# Altium project Panelmeter.PrjPcb
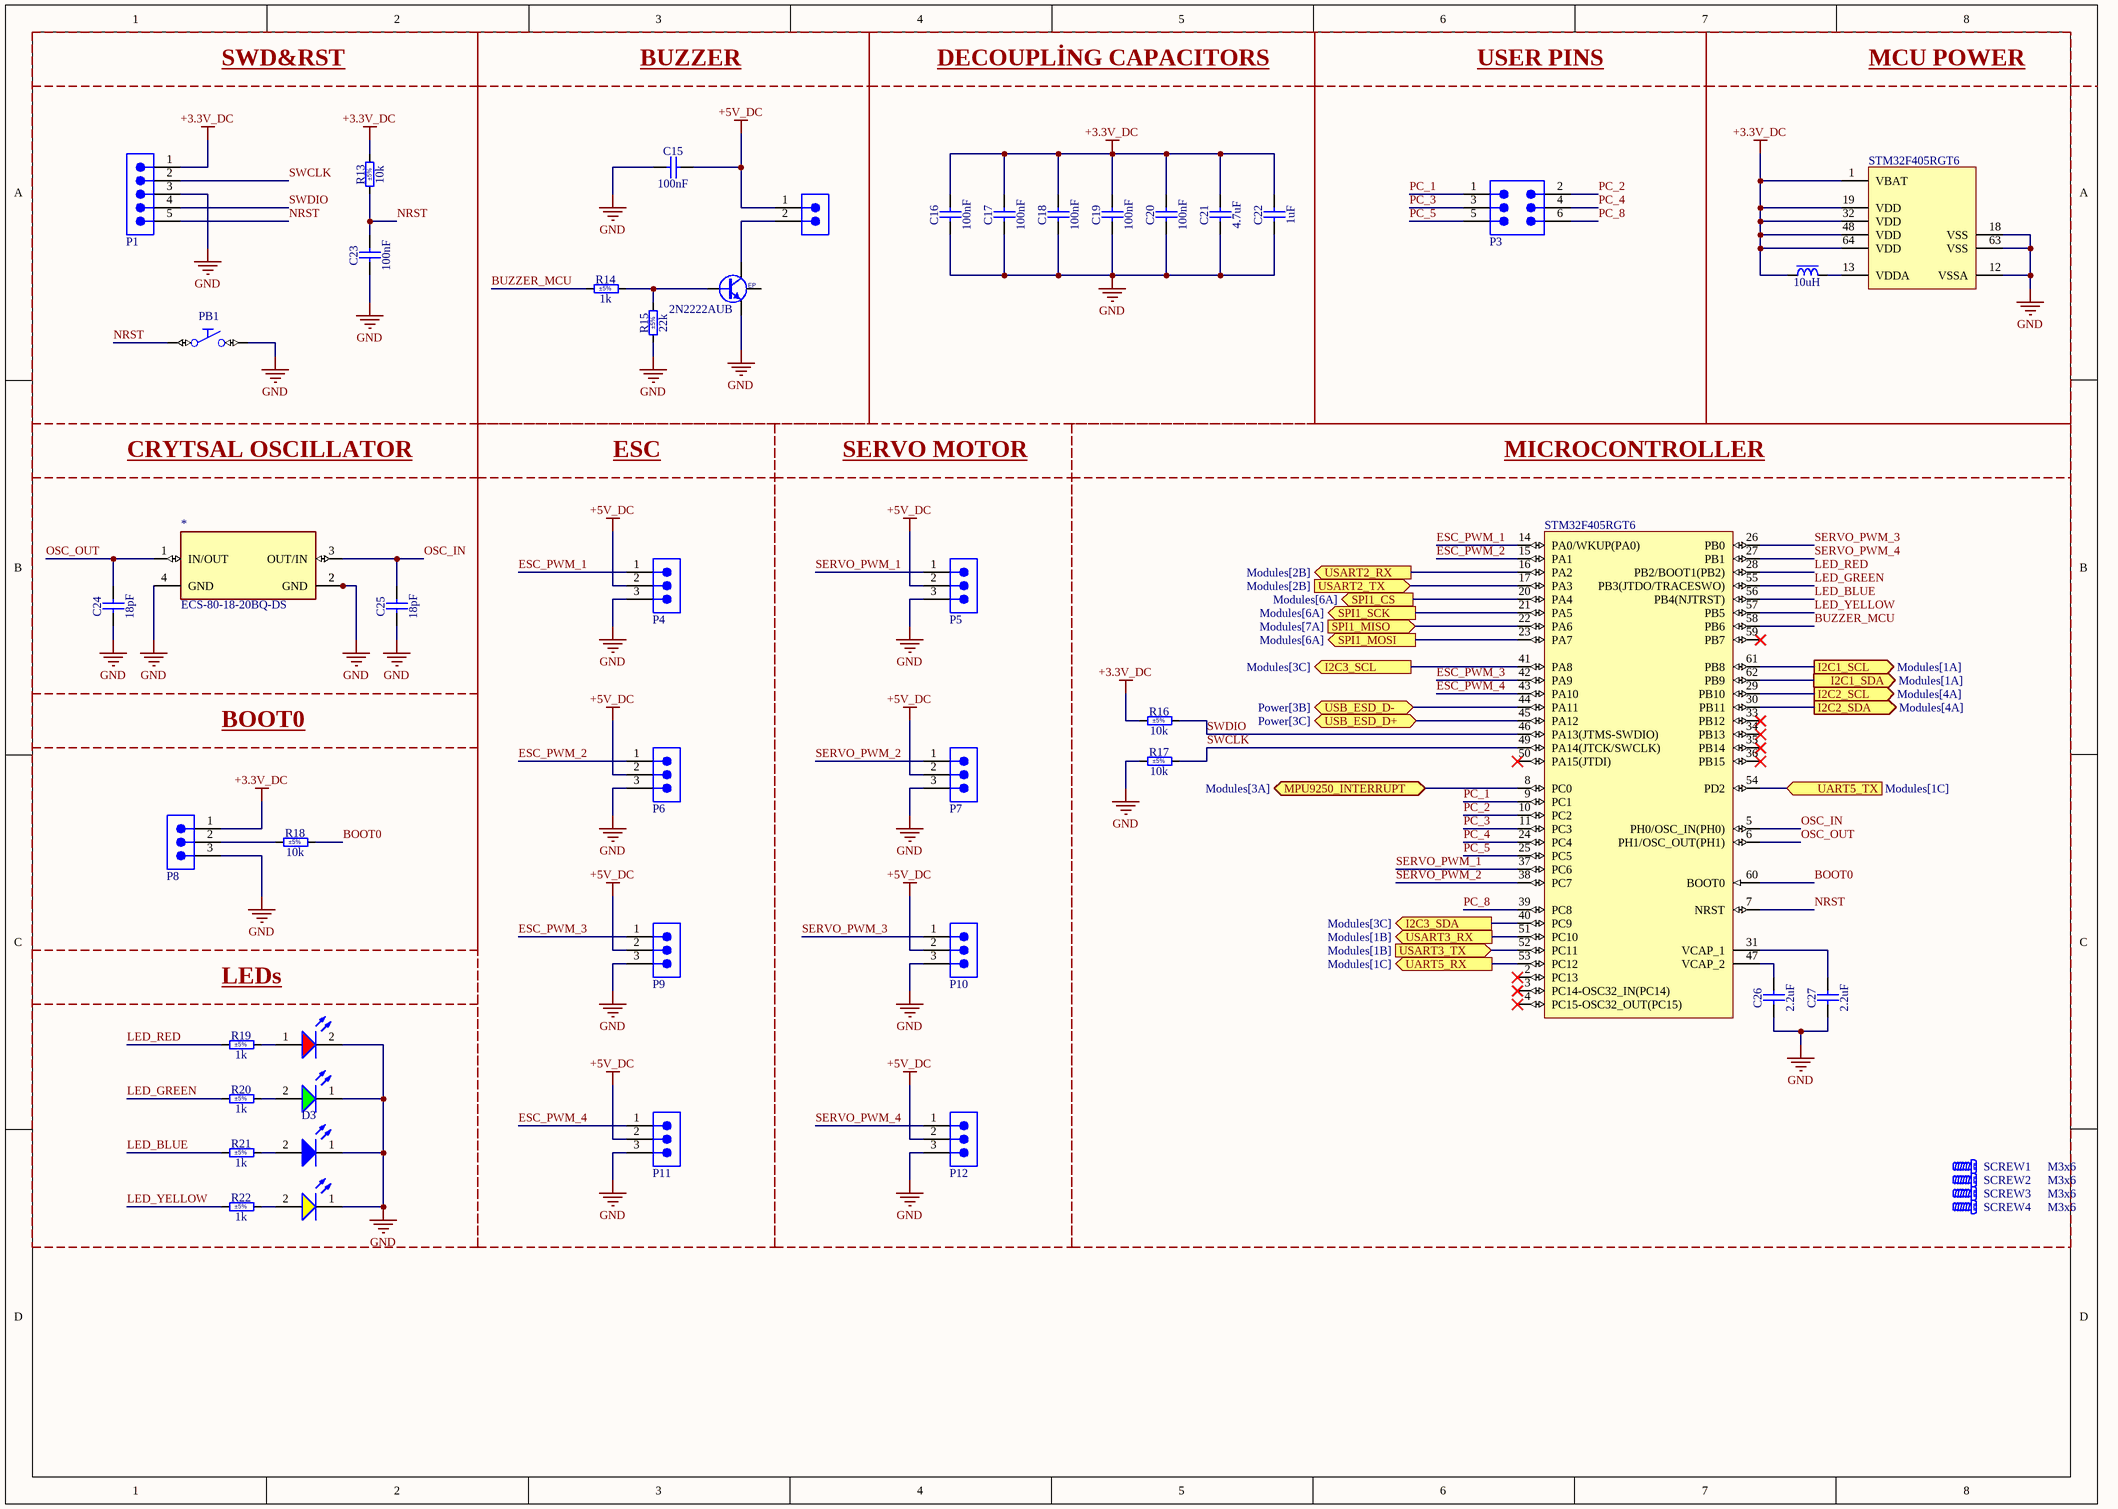
[diagram p0: MCU.SchDoc]
4 sheets, 91 parts. Net scope: flat (ports and power ports of the same name join across sheets).
Board file: Panelmeter_PCB.PcbDoc
Sheets:
  MCU.SchDoc
  Display.SchDoc
  USB2UART.SchDoc
  Analog.SchDoc

## Sheet MCU.SchDoc
size A3; SheetNumber: 2; SheetTotal: 3; SPICEModelCacheELPNFJPW: <root> / <DocumentId>ELPNFJPW</DocumentId> / <CacheFrame Number="0"> / <Model Name="0603_150060rs75003" Kind="CKT"> / <Text>****** / .subckt 0603_150060RS75003  1  2 / D1 1 2 SMCW / .MODEL SMCW D / + IS=1.0025E-15 / + N=2.2259 / + RS=.3926 / + IKF=240.91E-6 / + CJO=1.0000E-12 / + M=.3333 / + VJ=.75 / + BV=5 / + IBV=10.00E-6 / + TT=5.0000E-9 / .ends</Text> / </Model> / <Model Name="0603_150060vs55040" Kind="CKT"> / <Text>***************************** / .subckt 0603_150060VS55040 1 2 / D1 1 2 SMCD / .MODEL SMCD D / + IS=135.21E-15 / + N=2.0992 / + RS=1.0413 / + IKF=173.47E-9 / + CJO=1.0000E-12 / + M=.3333 / + VJ=.75 / + BV=5 / + IBV=100.00E-6 / + TT=5.0000E-9 / .ends</Text> / </Model> / <Model Name="0603_150060ys55040" Kind="CKT"> / <Text>***************************** / .subckt 0603_150060YS55040 1 2 / D1 1 2 SMCD / .MODEL SMCD D / + IS=135.21E-15 / + N=2.0992 / + RS=1.0413 / + IKF=173.47E-9 / + CJO=1.0000E-12 / + M=.3333 / + VJ=.75 / + BV=5 / + IBV=100.00E-6 / + TT=5.0000E-9 / .ends</Text> / </Model> / <Model Name="0603_150060bs75020" Kind="CKT"> / <Text>****** / .subckt 0603_150060BS75020  1  2 / D1 1 2 SMCW / .MODEL SMCW D / + IS=7.6676E-9 / + N=5 / + RS=2.6261 / + IKF=1.3194E-6 / + CJO=1.0000E-12 / + M=.3333 / + VJ=.75 / + BV=5 / + IBV=10.00E-6 / + TT=5.0000E-9 / .ends</Text> / </Model> / </CacheFrame> / </root>

### Parts
(Parts that share a designator on the sheet are numbered #1, #2 ... from top to bottom, then left to right.)
*  ECS-80-18-20BQ-DS  [ECS-80-18-20BQ-DS]
C15#1  100nF  [CAPC2012X135N]
C16#1  100nF  [CAPC2012X135N]
C17#1  100nF  [CAPC2012X135N]
C18#1  100nF  [CAPC2012X135N]
C19#1  100nF  [CAPC2012X135N]
C20#1  100nF  [CAPC2012X135N]
C21#1  4.7uF  [CAPC2012X135N]
C22#1  1uF  [CAPC2012X145N]
C23#1  100nF  [CAPC2012X135N]
C24#1  18pF  [CAPC2012X135N]
C25  18pF  [CAPC2012X135N]
C26  2.2uF  [CAPC2012X135N]
C27  2.2uF  [CAPC2012X135N]
D3  Blue, 3.2V, 140°  [WL-SMCW_0603_150060xx75020]  (value not drawn)
D5#1  Red, 2V, 140°  [WL-SMCW_0603_150060xx75003]  (value not drawn)
D6#1  Bright Green, 2V, 140°  [WL-SMCD_0603]  (value not drawn)
D8  Yellow, 2V, 140°  [WL-SMCD_0603]  (value not drawn)
IC1  STM32F405RGT6  [QFP50P1200X1200X160-64N]  (parts A,B of 2)
L3  10uH  [IND_MURATA-PS_8200]
P1  61300511121  [61300511121]  (value not drawn)
P2  691322310002  [691322310002]  (value not drawn)
P3#1  61300621121  [61300621121]  (value not drawn)
P4#1  61300311121  [61300311121]  (value not drawn)
P5  61300311121  [61300311121]  (value not drawn)
P6  61300311121  [61300311121]  (value not drawn)
P7  61300311121  [61300311121]  (value not drawn)
P8  61300311121  [61300311121]  (value not drawn)
P9  61300311121  [61300311121]  (value not drawn)
P10  61300311121  [61300311121]  (value not drawn)
P11  61300311121  [61300311121]  (value not drawn)
P12  61300311121  [61300311121]  (value not drawn)
PB1  Push Button  [PB_C&K_KSR2xxGLF]  (value not drawn)
R13#1  10k  Tolerance: ±5%  [RESC2012X60N]
R14#1  1k  Tolerance: ±5%  [RESC2012X60N]
R15#1  22k  Tolerance: ±5%  [RESC2012X60N]
R16#1  10k  Tolerance: ±5%  [RESC2012X60N]
R17#1  10k  Tolerance: ±5%  [RESC2012X60N]
R18#1  10k  Tolerance: ±5%  [RESC2012X60N]
R19#1  1k  Tolerance: ±5%  [RESC2012X60N]
R20#1  1k  Tolerance: ±5%  [RESC2012X60N]
R21#1  1k  Tolerance: ±5%  [RESC2012X60N]
R22#1  1k  Tolerance: ±5%  [RESC2012X60N]
SCREW1  M3x6  [BOSSARD_BN5687-3061605_v]
SCREW2  M3x6  [BOSSARD_BN5687-3061605_v]
SCREW3  M3x6  [BOSSARD_BN5687-3061605_v]
SCREW4  M3x6  [BOSSARD_BN5687-3061605_v]
T1  2N2222AUB  [MICROSEMI_UB]

### Blocks framed on the sheet
SWD&RST: C23#1 P1 PB1 R13#1
BUZZER: C15#1 P2 R14#1 R15#1 T1
DECOUPLİNG CAPACITORS: C16#1 C17#1 C18#1 C19#1 C20#1 C21#1 C22#1
USER PINS: P3#1
MCU POWER: IC1 L3
CRYTSAL OSCILLATOR: * C24#1 C25
ESC: P4#1 P6 P9 P11
SERVO MOTOR: P5 P7 P10 P12
MICROCONTROLLER: C26 C27 IC1 R16#1 R17#1 SCREW1-SCREW4
BOOT0: P8 R18#1
LEDs: D3 D5#1 D6#1 D8 R19#1 R20#1 R21#1 R22#1

### Ports
I2C1_SCL (out, see Modules[1A]), I2C1_SDA (out, see Modules[1A]), I2C2_SCL (out, see Modules[4A]), I2C2_SDA (out, see Modules[4A]), I2C3_SCL (out, see Modules[3C]), I2C3_SDA (out, see Modules[3C]), MPU9250_INTERRUPT (bidir, see Modules[3A]), SPI1_CS (out, see Modules[6A]), SPI1_MISO (in, see Modules[7A]), SPI1_MOSI (out, see Modules[6A]), SPI1_SCK (out, see Modules[6A]), UART5_RX (out, see Modules[1C]), UART5_TX (in, see Modules[1C]), USART2_RX (out, see Modules[2B]), USART2_TX (in, see Modules[2B]), USART3_RX (out, see Modules[1B]), USART3_TX (in, see Modules[1B]), USB_ESD_D+ (bidir, see Power[3C]), USB_ESD_D- (bidir, see Power[3B])

### Nets
+3.3V_DC: C16#1.2 C17#1.2 C18#1.2 C19#1.2 C20#1.2 C21#1.2 C22#1.2 IC1.1(VBAT) IC1.19(VDD) IC1.32(VDD) IC1.48(VDD) IC1.64(VDD) L3.1 P1.1 P8.1 R13#1.2 R16#1.1
+5V_DC: C15#1.2 P2.1 P4#1.2 P5.2 P6.2 P7.2 P9.2 P10.2 P11.2 P12.2
GND: *.2(GND) *.4(GND) C15#1.1 C16#1.1 C17#1.1 C18#1.1 C19#1.1 C20#1.1 C21#1.1 C22#1.1 C23#1.1 C24#1.1 C25.1 C26.1 C27.1 D3.1(K) D5#1.2(K) D6#1.1(K) D8.1(K) IC1.12(VSSA) IC1.18(VSS) IC1.63(VSS) P1.3 P4#1.3 P5.3 P6.3 P7.3 P8.3 P9.3 P10.3 P11.3 P12.3 PB1.2(NO) R15#1.1 R17#1.1 T1.2(E)
BOOT0: IC1.60(BOOT0) R18#1.2
BUZZER_MCU: IC1.58(PB6) R14#1.1
ESC_PWM_1: IC1.14(PA0/WKUP(PA0)) P4#1.1
ESC_PWM_2: IC1.15(PA1) P6.1
ESC_PWM_3: IC1.42(PA9) P9.1
ESC_PWM_4: IC1.43(PA10) P11.1
LED_BLUE: IC1.56(PB4(NJTRST)) R21#1.1
LED_GREEN: IC1.55(PB3(JTDO/TRACESWO)) R20#1.1
LED_RED: IC1.28(PB2/BOOT1(PB2)) R19#1.1
LED_YELLOW: IC1.57(PB5) R22#1.1
NRST: C23#1.2 IC1.7(NRST) P1.5 PB1.1(C) R13#1.1
OSC_IN: *.3(OUT/IN) C25.2 IC1.5(PH0/OSC_IN(PH0))
OSC_OUT: *.1(IN/OUT) C24#1.2 IC1.6(PH1/OSC_OUT(PH1))
PC_1: IC1.9(PC1) P3#1.1
PC_2: IC1.10(PC2) P3#1.2
PC_3: IC1.11(PC3) P3#1.3
PC_4: IC1.24(PC4) P3#1.4
PC_5: IC1.25(PC5) P3#1.5
PC_8: IC1.39(PC8) P3#1.6
SERVO_PWM_1: IC1.37(PC6) P5.1
SERVO_PWM_2: IC1.38(PC7) P7.1
SERVO_PWM_3: IC1.26(PB0) P10.1
SERVO_PWM_4: IC1.27(PB1) P12.1
SWCLK: IC1.49(PA14(JTCK/SWCLK)) P1.2 R17#1.2
SWDIO: IC1.46(PA13(JTMS-SWDIO)) P1.4 R16#1.2
NetC26_2: C26.2 IC1.47(VCAP_2)
NetC27_2: C27.2 IC1.31(VCAP_1)
NetD3_2: D3.2(A) R21#1.2
NetD5#1_1: D5#1.1(A) R19#1.2
NetD6#1_2: D6#1.2(A) R20#1.2
NetD8_2: D8.2(A) R22#1.2
NetIC1_8: IC1.8(PC0) ; port MPU9250_INTERRUPT
NetIC1_13: IC1.13(VDDA) L3.2
NetIC1_16: IC1.16(PA2) ; port USART2_RX
NetIC1_17: IC1.17(PA3) ; port USART2_TX
NetIC1_20: IC1.20(PA4) ; port SPI1_CS
NetIC1_21: IC1.21(PA5) ; port SPI1_SCK
NetIC1_22: IC1.22(PA6) ; port SPI1_MISO
NetIC1_23: IC1.23(PA7) ; port SPI1_MOSI
NetIC1_29: IC1.29(PB10) ; port I2C2_SCL
NetIC1_30: IC1.30(PB11) ; port I2C2_SDA
NetIC1_40: IC1.40(PC9) ; port I2C3_SDA
NetIC1_41: IC1.41(PA8) ; port I2C3_SCL
NetIC1_44: IC1.44(PA11) ; port USB_ESD_D-
NetIC1_45: IC1.45(PA12) ; port USB_ESD_D+
NetIC1_51: IC1.51(PC10) ; port USART3_RX
NetIC1_52: IC1.52(PC11) ; port USART3_TX
NetIC1_53: IC1.53(PC12) ; port UART5_RX
NetIC1_54: IC1.54(PD2) ; port UART5_TX
NetIC1_61: IC1.61(PB8) ; port I2C1_SCL
NetIC1_62: IC1.62(PB9) ; port I2C1_SDA
NetP2_2: P2.2 T1.3(C)
NetP8_2: P8.2 R18#1.1
NetR14#1_2: R14#1.2 R15#1.2 T1.1(B)

Not connected (* = marked no-connect by the designer): IC1 2(PC13)* 3(PC14-OSC32_IN(PC14))* 4(PC15-OSC32_OUT(PC15))* 33(PB12)* 34(PB13)* 35(PB14)* 36(PB15)* 50(PA15(JTDI))* 59(PB7)*; T1 4(EP)

### Library data of the parts
C15#1 C16#1 C17#1 C18#1 C19#1 C20#1 C23#1 = CC0805_100NF_50V_10%_X7R: Non-polarised capacitor; Part Description: SMD Multilayer Chip Ceramic Capacitor; Manufacturer: GENERIC; Manufacturer1 Part Number: C2012X7R1H104K085; Voltage: 50V; TC: X7R; Tolerance: ±10%; Part Number: CC0805_100NF_50V_10%_X7R; Component Kind: Standard; Component Type: Standard; Pin Count: 2; Value: 100nF; Status: None; Manufacturer Part Number: CC0805_100NF_50V_10%_X7R; Case: 0805; Mounted: Yes; Socket: No; SMD: Yes; Sense: No; Manufacturer1 Example: TDK; Manufacturer1 ComponentHeight: 1mm; HelpURL: \\cern.ch\dfs\Applications\Altium\Datasheets\CC0805_X7R_TDK_C.pdf; Author: CERN DEM JLC; CreateDate: 3.12.2007; LatestRevisionDate: 22.04.2015
C21#1 = CC0805_4.7UF_10V_10%_X5R: Non-polarised capacitor; Part Description: SMD Multilayer Chip Ceramic Capacitor; Manufacturer: GENERIC; Manufacturer1 Part Number: 222224013672; Voltage: 10V; TC: X5R; Tolerance: ±10%; Part Number: CC0805_4.7UF_10V_10%_X5R; Component Kind: Standard; Component Type: Standard; Pin Count: 2; Value: 4.7uF; Status: Preferred; Manufacturer Part Number: CC0805_4.7UF_10V_10%_X5R; Case: 0805; Mounted: Yes; Socket: No; SMD: Yes; Sense: No; Manufacturer1 Example: PHYCOMP; Manufacturer1 ComponentHeight: 1.45mm; HelpURL: \\cern.ch\dfs\Applications\Altium\Datasheets\CC0805_X5R_PHYCOMP_HC.pdf; Author: CERN DEM JLC; CreateDate: 3.12.2007; LatestRevisionDate: 3.12.2007
C22#1 = CC0805_1UF_100V_10%_X7S_YUDEN_HMK212BC7105KGHTE: Non-polarised capacitor; Part Description: SMD Multilayer Chip Ceramic Capacitor for Automotive / Industrial Applications; Manufacturer: TAIYO YUDEN; Voltage: 100V; TC: X7S; Tolerance: ±10%; Part Number: CC0805_1UF_100V_10%_X7S_YUDEN_HMK212BC7105KGHTE; Component Kind: Standard; Component Type: Standard; Pin Count: 2; Value: 1uF; Status: Not Recommended; Manufacturer Part Number: HMK212BC7105KGHTE; Case: 0805; Mounted: Yes; Socket: No; SMD: Yes; Sense: No; ComponentHeight: 1.45mm; HelpURL: \\cern.ch\dfs\Applications\Altium\Datasheets\CC0805_TAIYO-YUDEN_HMK212BC7105KGHTE.pdf; Author: CERN DEM JLC; CreateDate: 9.05.2017; LatestRevisionDate: 9.05.2017
C24#1 C25 = CC0805_18PF_50V_5%_NP0: Non-polarised capacitor; Part Description: SMD Multilayer Chip Ceramic Capacitor; Manufacturer: GENERIC; Manufacturer1 Part Number: 223886115189; Voltage: 50V; TC: C0G/NP0; Tolerance: ±5%; Part Number: CC0805_18PF_50V_5%_NP0; Component Kind: Standard; Component Type: Standard; Pin Count: 2; Value: 18pF; Status: Preferred; Manufacturer Part Number: CC0805_18PF_50V_5%_NP0; Case: 0805; Mounted: Yes; Socket: No; SMD: Yes; Sense: No; Manufacturer1 Example: PHYCOMP; Manufacturer1 ComponentHeight: 1.35mm; HelpURL: \\cern.ch\dfs\Applications\Altium\Datasheets\CC0805_NP0_PHYCOMP.pdf; Author: CERN DEM JLC; CreateDate: 3.12.2007; LatestRevisionDate: 3.12.2007
C26 C27 = CC0805_2.2UF_16V_10%_X7R: Non-polarised capacitor; Part Description: SMD Multilayer Chip Ceramic Capacitor; Manufacturer: GENERIC; Manufacturer1 Part Number: GRM21BF51C225ZA01L; Voltage: 16V; TC: X7R; Tolerance: ±10%; Part Number: CC0805_2.2UF_16V_10%_X7R; Component Kind: Standard; Component Type: Standard; Pin Count: 2; Value: 2.2uF; Status: Preferred; Manufacturer Part Number: CC0805_2.2UF_16V_10%_X7R; Case: 0805; Mounted: Yes; Socket: No; SMD: Yes; Sense: No; Manufacturer1 Example: MURATA; Manufacturer1 ComponentHeight: 1.5mm; HelpURL: \\cern.ch\dfs\Applications\Altium\Datasheets\CC0805_X7R_MURATA_GRM.pdf; Author: CERN DEM JLC; CreateDate: 3.12.2007; LatestRevisionDate: 18.09.2014
D3 = 150060BS75020: WL-SMCW Mono-color Chip LED Waterclear, size 0603, Blue, 3.2V, 140°; Manufacturer: Wurth Elektronik; Case/Size Code: 0603; Chip Technology: InGaN; Dominant Wavelength: 470nm; Luminous Intensity: 150mcd; Peak Wavelength: 465nm; Manufacturer Part Number: 150060BS75020; Category: Signal LEDs; Match Code: WL-SMCW; ComponentLink1Description: Website Link; ComponentLink1URL: https://www.we-online.com/redexpert/article/150060BS75020?ad; ComponentLink2Description: Datasheet Link; ComponentLink2URL: https://www.we-online.com/redexpert/spec/150060BS75020?ad; Mount: Surface Mount; Operating Temperature Max: 85°C; Operating Temperature Min: -40°C; Packaging: Tape and Reel; Length: 1.6mm; Width: 0.8mm; Height: 0.25mm; Emitting Color: Blue; Forward Voltage: 3.2V; Viewing Angle: 140°
D5#1 = 150060RS75003: WL-SMCW Mono-color Chip LED Waterclear, size 0603, Red, 2V, 140°; Manufacturer: Wurth Elektronik; Case/Size Code: 0603; Chip Technology: AlInGaP; Dominant Wavelength: 625nm; Luminous Intensity: 530mcd; Peak Wavelength: 630nm; Manufacturer Part Number: 150060RS75003; Category: Signal LEDs; Match Code: WL-SMCW; ComponentLink1Description: Website Link; ComponentLink1URL: https://www.we-online.com/redexpert/article/150060RS75003?ad; ComponentLink2Description: Datasheet Link; ComponentLink2URL: https://www.we-online.com/redexpert/spec/150060RS75003?ad; Mount: Surface Mount; Operating Temperature Max: 100°C; Operating Temperature Min: -40°C; Packaging: Tape and Reel; Length: 1.6mm; Width: 0.8mm; Height: 0.7mm; Emitting Color: Red; Forward Voltage: 2V; Viewing Angle: 140°
D6#1 = 150060VS55040: WL-SMCD Mono-color Chip LED Diffused, SMT, size 0603, Bright Green, 2V, 140°; Manufacturer: Wurth Elektronik; Case/Size Code: 0603; Chip Technology: AlInGaP; Dominant Wavelength: 573nm; Luminous Intensity: 60mcd; Peak Wavelength: 575nm; Manufacturer Part Number: 150060VS55040; Category: Signal LEDs; Match Code: WL-SMCD; ComponentLink1Description: Website Link; ComponentLink1URL: https://www.we-online.com/redexpert/article/150060VS55040?ad; ComponentLink2Description: Datasheet Link; ComponentLink2URL: https://www.we-online.com/redexpert/spec/150060VS55040?ad; Mount: Surface Mount; Operating Temperature Max: 85°C; Operating Temperature Min: -40°C; Packaging: Tape and Reel; Length: 1.6mm; Width: 0.8mm; Height: 0.4mm; Emitting Color: Bright Green; Forward Voltage: 2V; Viewing Angle: 140°
D8 = 150060YS55040: WL-SMCD Mono-color Chip LED Diffused, SMT, size 0603, Yellow, 2V, 140°; Manufacturer: Wurth Elektronik; Case/Size Code: 0603; Chip Technology: AlInGaP; Dominant Wavelength: 589nm; Luminous Intensity: 100mcd; Peak Wavelength: 591nm; Manufacturer Part Number: 150060YS55040; Category: Signal LEDs; Match Code: WL-SMCD; ComponentLink1Description: Website Link; ComponentLink1URL: https://www.we-online.com/redexpert/article/150060YS55040?ad; ComponentLink2Description: Datasheet Link; ComponentLink2URL: https://www.we-online.com/redexpert/spec/150060YS55040?ad; Mount: Surface Mount; Operating Temperature Max: 85°C; Operating Temperature Min: -40°C; Packaging: Tape and Reel; Length: 1.6mm; Width: 0.8mm; Height: 0.4mm; Emitting Color: Yellow; Forward Voltage: 2V; Viewing Angle: 140°
IC1 = STM32F405RGT6: ARM Cortex-M4 32-bit MCU+FPU, 210DMIPS, 1024kB Flash, 192kB+4kB RAM, 51 I/Os, 64-pin LQFP, Industrial Grade –40 to 85°C; Part Description: ARM Cortex-M4 32-bit MCU+FPU, 210DMIPS, 1024KB Flash, 192+4 KB RAM, 51 I/Os, 64-pin LQFP, Industrial Grade –40 to 85°C; Manufacturer: ST MICROELECTRONICS; PressFit: No; Bonding: No; Part Number: STM32F405RGT6; Component Kind: Standard; Component Type: Standard; Device: STM32F405RGT6; PackageDescription: QFP, 0.50mm Pitch, Square; 64 Pin, 10.0mm L X 10.0mm W X 1.60mm H body, IPC Medium Density; Manufacturer Part Number: STM32F405RGT6; Pin Count: 64; Case: QFP64; Mounted: Yes; Socket: No; SMD: Yes; Sense: No; ComponentHeight: 1.6mm; HelpURL: \\cern.ch\dfs\Applications\Altium\Datasheets\STM32F405RGT6.pdf; Author: CERN DEM JLC; CreateDate: 20.06.2017; LatestRevisionDate: 20.06.2017
L3 = IND_10UH_10%_MURATA-PS_8200: Inductor With Core; Part Description: Miniature Surface Mount Power Inductor (8200 Series); Manufacturer: MURATA POWER SOLUTIONS; Manufacturer Part Number: 82103C; Power: 500mA; Resistance: 0.4R; Tolerance: ±10%; Part Number: IND_10UH_10%_MURATA-PS_8200; Component Kind: Standard; Component Type: Standard; Pin Count: 2; Value: 10uH; Mounted: Yes; Socket: No; SMD: Yes; Sense: No; ComponentHeight: 2.3mm; HelpURL: \\cern.ch\dfs\Applications\Altium\Datasheets\IND_MURATA-PS_8200.pdf; Author: CERN DEM JLC; CreateDate: 21.07.2014; LatestRevisionDate: 21.07.2014
P1 = 61300511121: WR-PHD Pin Header, THT, Vertical, pitch 2.54mm, 1 Row, 5P; Manufacturer: Wurth Elektronik; Contact Resistance: 20mOhm; Rated Current: 3A; Working Voltage: 250V; Withstanding Voltage: 500V; Manufacturer Part Number: 61300511121; Category: Board-to-Board Connectors; Match Code: WR-PHD; ComponentLink1Description: Website Link; ComponentLink1URL: https://www.we-online.com/redexpert/article/61300511121?ad; ComponentLink2Description: Datasheet Link; ComponentLink2URL: https://www.we-online.com/redexpert/spec/61300511121?ad; Mount: Through Hole; Operating Temperature Max: 105°C; Operating Temperature Min: -40°C; Packaging: Bag; Gender: Pin Header; Number of Pins: 5; Number of Rows: 1; Orientation: Vertical; Pitch: 2.54mm
P2 = 691322310002: WR-TBL Series 322 Horizontal PCB Header, THT, pitch 3.81mm, 2p; Manufacturer: Wurth Elektronik; Modularity: No; Rated Current: 10A; Working Voltage: 300V; Manufacturer Part Number: 691322310002; Category: Terminal Blocks; Match Code: WR-TBL; ComponentLink1Description: Website Link; ComponentLink1URL: https://www.we-online.com/redexpert/article/691322310002?ad; ComponentLink2Description: Datasheet Link; ComponentLink2URL: https://www.we-online.com/redexpert/spec/691322310002?ad; Mount: Through Hole; Operating Temperature Max: 105°C; Operating Temperature Min: -40°C; Packaging: Box; Application: Pluggable; Number of Pins: 2; Number of Rows: 1; Orientation: Horizontal; Pitch: 3.81mm
P3#1 = 61300621121: WR-PHD Pin Header, THT, Vertical, pitch 2.54mm, 2 Row, 6P; Manufacturer: Wurth Elektronik; Contact Resistance: 20mOhm; Rated Current: 3A; Working Voltage: 250V; Withstanding Voltage: 500V; Manufacturer Part Number: 61300621121; Category: Board-to-Board Connectors; Match Code: WR-PHD; ComponentLink1Description: Website Link; ComponentLink1URL: https://www.we-online.com/redexpert/article/61300621121?ad; ComponentLink2Description: Datasheet Link; ComponentLink2URL: https://www.we-online.com/redexpert/spec/61300621121?ad; Mount: Through Hole; Operating Temperature Max: 105°C; Operating Temperature Min: -40°C; Packaging: Bag; Gender: Pin Header; Number of Pins: 6; Number of Rows: 2; Orientation: Vertical; Pitch: 2.54mm
P4#1 P5-P12 = 61300311121: WR-PHD Pin Header, THT, Vertical, pitch 2.54mm, 1 Row, 3P; Manufacturer: Wurth Elektronik; Contact Resistance: 20mOhm; Rated Current: 3A; Working Voltage: 250V; Withstanding Voltage: 500V; Manufacturer Part Number: 61300311121; Category: Board-to-Board Connectors; Match Code: WR-PHD; ComponentLink1Description: Website Link; ComponentLink1URL: https://www.we-online.com/redexpert/article/61300311121?ad; ComponentLink2Description: Datasheet Link; ComponentLink2URL: https://www.we-online.com/redexpert/spec/61300311121?ad; Mount: Through Hole; Operating Temperature Max: 105°C; Operating Temperature Min: -40°C; Packaging: Bag; Gender: Pin Header; Number of Pins: 3; Number of Rows: 1; Orientation: Vertical; Pitch: 2.54mm
PB1 = PB_C&K_KSR223GLFG: Push-Button Switch SPST; Part Description: 32VDC 10mA SPST-NO Surface Mount Subminiature Tact Momentary Pushbutton Switch, Operating Force 2N; Manufacturer: C&K; PressFit: No; Sense Comment: Non-washable; Part Number: PB_C&K_KSR223GLFG; Component Kind: Standard; Component Type: Standard; Pin Count: 2; PackageDescription: Body 7.3x3.8mm, Surface Mount Subminiature Tact Switch, C&K KSR Series; Family: Push Button; Mounted: Yes; Socket: No; SMD: Yes; Sense: Yes; Status: None; Manufacturer Part Number: KSR223GLFG; ComponentHeight: 2.5mm; HelpURL: \\cern.ch\dfs\Applications\Altium\Datasheets\PB_C&K_KSR-Series.pdf; Author: CERN DEM HF; CreateDate: 5.10.2021; LatestRevisionDate: 5.10.2021
R13#1 R16#1 R17#1 = R0805_10K_0.1%_0.1W_10PPM: Resistor - 0.1%; Part Description: Thin Film Chip Resistor; Manufacturer: GENERIC; Manufacturer1 Part Number: RN73C2A10KBTG; Power: 0.1W; TC: ±10ppm; PressFit: No; Part Number: R0805_10K_0.1%_0.1W_10PPM; Component Kind: Standard; Component Type: Standard; Pin Count: 2; Value: 10k; Status: Not Recommended; Manufacturer Part Number: R0805_10K_0.1%_0.1W_10PPM; Case: 0805; Mounted: Yes; Sense: No; Socket: No; SMD: Yes; Manufacturer1 Example: TYCO HOLSWORTHY; Manufacturer1 ComponentHeight: 0.6mm; HelpURL: \\cern.ch\dfs\Applications\Altium\Datasheets\R0805_Tyco_RN73.pdf; Author: CERN DEM JLC; CreateDate: 3.12.2007; LatestRevisionDate: 13.03.2008
R14#1 R19#1 R20#1 R21#1 R22#1 = R0805_1K_0.1%_0.125W_25PPM: Resistor - 0.1%; Part Description: Thin Film Chip Resistor; Manufacturer: GENERIC; Manufacturer1 Part Number: ERA6AEB102V; Power: 0.125W; TC: ±25ppm; PressFit: No; Part Number: R0805_1K_0.1%_0.125W_25PPM; Component Kind: Standard; Component Type: Standard; Pin Count: 2; Value: 1k; Status: Not Recommended; Manufacturer Part Number: R0805_1K_0.1%_0.125W_25PPM; Case: 0805; Mounted: Yes; Sense: No; Socket: No; SMD: Yes; Manufacturer1 Example: PANASONIC; Manufacturer1 ComponentHeight: 0.6mm; HelpURL: \\cern.ch\dfs\Applications\Altium\Datasheets\R0805_PANASONIC_ERA.pdf; Author: CERN DEM JLC; CreateDate: 18.10.2010; LatestRevisionDate: 18.10.2010
R15#1 = R0805_22K_1%_0.125W_100PPM: Resistor - 1%; Part Description: General Purpose Thick Film Chip Resistor; Manufacturer: GENERIC; Manufacturer1 Part Number: NRC10F2202TRF; Power: 0.125W; TC: ±100ppm/°C; PressFit: No; Part Number: R0805_22K_1%_0.125W_100PPM; Component Kind: Standard; Component Type: Standard; Pin Count: 2; Value: 22k; Status: Preferred; Manufacturer Part Number: R0805_22K_1%_0.125W_100PPM; Case: 0805; Mounted: Yes; Sense: No; Socket: No; SMD: Yes; Manufacturer1 Example: NIC COMPONENT; Manufacturer1 ComponentHeight: 0.6mm; HelpURL: \\cern.ch\dfs\Applications\Altium\Datasheets\R0805_NIC_NRC.pdf; Author: CERN DEM JLC; CreateDate: 3.12.2007; LatestRevisionDate: 13.03.2008
R18#1 = R0805_100K_1%_0.125W_100PPM: Resistor - 1%; Part Description: General Purpose Thick Film Chip Resistor; Manufacturer: GENERIC; Manufacturer1 Part Number: NRC10F1003TRF; Value: 100k; Power: 0.125W; TC: ±100ppm/°C; PressFit: No; Part Number: R0805_100K_1%_0.125W_100PPM; Component Kind: Standard; Component Type: Standard; Pin Count: 2; Status: Preferred; Manufacturer Part Number: R0805_100K_1%_0.125W_100PPM; Case: 0805; Mounted: Yes; Sense: No; Socket: No; SMD: Yes; Manufacturer1 Example: NIC COMPONENT; Manufacturer1 ComponentHeight: 0.6mm; HelpURL: \\cern.ch\dfs\Applications\Altium\Datasheets\R0805_NIC_NRC.pdf; Author: CERN DEM JLC; CreateDate: 3.12.2007; LatestRevisionDate: 13.03.2008
SCREW1-SCREW4 = BOSSARD_BN5687-3061605_v: Screw; Part Description: M3 L=6mm Hexalobular Socket Pan Head Screw, Fully Threaded, Stainless Steel A2; Manufacturer Part Number: BN5687 Art.3061605; PressFit: No; Part Number: BOSSARD_BN5687-3061605_v; Component Kind: Standard; Component Type: Mechanical; Pin Count: 0; PackageDescription: M3 L=6mm Hexalobular Socket Pan Head Screw, Fully Threaded - Stainless Steel A2; Mounted: Yes; Socket: No; SMD: No; Sense: No; Status: None; Value: M3x6; Manufacturer: BOSSARD; ComponentHeight: 2.4mm; HelpURL: \\cern.ch\dfs\Applications\Altium\Datasheets\BOSSARD_BN5687-3061605.pdf; Author: CERN DEM JLC; CreateDate: 15.01.2013; LatestRevisionDate: 15.01.2013
T1 = 2N2222AUB: NPN Transistor + Exposed Pad; Part Description: 50V 800mA NPN Silicon Switching Transistor; Manufacturer: MICROSEMI; PressFit: No; Bonding: No; Part Number: 2N2222AUB; Component Kind: Standard; Component Type: Standard; Device: 2N2222AUB; PackageDescription: MICROSEMI UB Case, 2.45mm L x 3.08mm W 1.42mm H body; Manufacturer Part Number: 2N2222AUB; Pin Count: 4; Mounted: Yes; Socket: No; SMD: Yes; Sense: No; ComponentHeight: 1.42mm; HelpURL: \\cern.ch\dfs\Applications\Altium\Datasheets\2N2222AUB.pdf; Author: CERN DEM BC; CreateDate: 28.05.2020; LatestRevisionDate: 28.05.2020

## Sheet Display.SchDoc
size A4; SheetNumber: 2; SheetTotal: 4
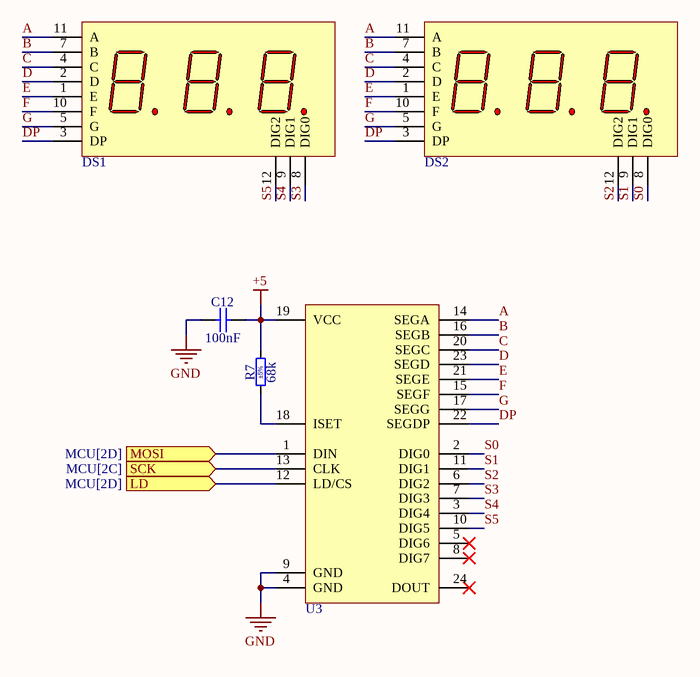
[diagram p1: Display.SchDoc]

### Parts
C12  100nF  [CAPC2012X135N]
DS1  7SEGMENT-3DIG-CC  [7SEGMENT-3DIG]  (value not drawn)
DS2  7SEGMENT-3DIG-CC  [7SEGMENT-3DIG]  (value not drawn)
R7  68k  Tolerance: ±5%  [RESC2012X60N]
U3  MAX7219CWG+  [SOIC-24W]  (value not drawn)

### Ports
LD (in, see MCU[2D]), MOSI (in, see MCU[2D]), SCK (in, see MCU[2C])

### Nets
+5: C12.2 R7.2 U3.19(VCC)
GND: C12.1 U3.4(GND) U3.9(GND)
A: DS1.11(A) DS2.11(A) U3.14(SEGA)
B: DS1.7(B) DS2.7(B) U3.16(SEGB)
C: DS1.4(C) DS2.4(C) U3.20(SEGC)
D: DS1.2(D) DS2.2(D) U3.23(SEGD)
DP: DS1.3(DP) DS2.3(DP) U3.22(SEGDP)
E: DS1.1(E) DS2.1(E) U3.21(SEGE)
F: DS1.10(F) DS2.10(F) U3.15(SEGF)
G: DS1.5(G) DS2.5(G) U3.17(SEGG)
S0: DS2.8(DIG0) U3.2(DIG0)
S1: DS2.9(DIG1) U3.11(DIG1)
S2: DS2.12(DIG2) U3.6(DIG2)
S3: DS1.8(DIG0) U3.7(DIG3)
S4: DS1.9(DIG1) U3.3(DIG4)
S5: DS1.12(DIG2) U3.10(DIG5)
NetR7_1: R7.1 U3.18(ISET)
NetU3_1: U3.1(DIN) ; port MOSI
NetU3_12: U3.12(LD/CS) ; port LD
NetU3_13: U3.13(CLK) ; port SCK

Not connected (* = marked no-connect by the designer): U3 5(DIG6)* 8(DIG7)* 24(DOUT)*

### Library data of the parts
C12 = CC0805_100NF_50V_10%_X7R: as C15#1 on sheet MCU; Part Number: CC0805_100NF_50V_10%_X7R; Component Kind: Standard; Component Type: Standard; Pin Count: 2; Value: 100nF; Status: None; Manufacturer Part Number: CC0805_100NF_50V_10%_X7R; Case: 0805; Mounted: Yes; Socket: No; SMD: Yes; Sense: No; Manufacturer1 Example: TDK; Manufacturer1 ComponentHeight: 1mm; HelpURL: \\cern.ch\dfs\Applications\Altium\Datasheets\CC0805_X7R_TDK_C.pdf; Author: CERN DEM JLC; CreateDate: 3.12.2007; LatestRevisionDate: 22.04.2015
R7 = R0805_68K_1%_0.125W_100PPM: Resistor - 5%; Part Description: General Purpose Thick Film Chip Resistor; Manufacturer: GENERIC; Manufacturer Part Number: R0805_68K_5%_0.125W_100PPM; Manufacturer1 Part Number: NRC10F6802TRF; Power: 0.125W; TC: ±100ppm/°C; PressFit: No; Part Number: R0805_68K_1%_0.125W_100PPM; Component Kind: Standard; Component Type: Standard; Pin Count: 2; Value: 68k; Status: Preferred; Case: 0805; Mounted: Yes; Sense: No; Socket: No; SMD: Yes; Manufacturer1 Example: NIC COMPONENT; Manufacturer1 ComponentHeight: 0.6mm; HelpURL: \\cern.ch\dfs\Applications\Altium\Datasheets\R0805_NIC_NRC.pdf; Author: CERN DEM JLC; CreateDate: 3.12.2007; LatestRevisionDate: 13.03.2008
U3 = MAX7219CWG+: LED Driver, 7-Segment, MOS, PDSO24; Manufacturer: Maxim; Package Body Material: Plastic; Output Polarity: True; Data Input Mode: SERIAL; fmax-Min: 1.3MHz; Input Characteristics: STANDARD; Interface IC Type: LED DISPLAY DRIVER; Multiplexed Display Capability: Yes; Number of Digits/Characters: 8; Channels: 1; Number of Segments: 7; Output Characteristics: TOTEM-POLE; Package Equivalence Code: SOP24,.4; Power Supplies: 5V; Max Supply Voltage: 5.5V; Min Supply Voltage: 4V; Qualification Status: Not Qualified; Supplier: Mouser; Supplier Part Number: 700-MAX7219CWG; Manufacturer Part Number: MAX7219CWG+; RoHS: Yes; Category: LED Drivers; Stock: 1573; Pricing: 1=13,84, 10=12,72, 50=12,2, 100=12,2, 1000=9,56, 10000=9,56 (USD); Case/Package: SOP; Pins: 24; Package Shape: Rectangular; Terminal Finish: Tin; Min Operating Temperature: 0°C; Max Operating Temperature: 70°C; JESD-609 Code: e3; Display Mode: Segment; JESD-30 Code: R-PDSO-G24; Moisture Sensitivity Level: 1; Package Style: SMALL OUTLINEMeter; Peak Reflow Temperature (Cel): 260°C; Nominal Supply Voltage: 5V; Surface Mount: Yes; Technology: MOS; Terminal Form: Gull Wing; Terminal Position: DUAL; Length: 15.4mm; Width: 7.5mm; Height - Seated (Max): 2.65mm; Terminal Pitch: 1.27mm; Temperature Grade: COMMERCIAL; Reach SVHC Compliant: Yes; RoHS Compliant: Yes; ComponentLink1URL: https://datasheet.ciiva.com:443/pdfs/VipMasterIC/IC/MAXM/MAXMS13376/MAXMS13376-1.pdf?src-supplier=IHS+Markit; ComponentLink1Description: https://datasheet.ciiva.com:443/pdfs/VipMasterIC/IC/MAXM/MAXMS13376/MAXMS13376-1.pdf?src-supplier=IHS+Markit; ComponentLink2URL: https://www.distrelec.biz/Web/Downloads/_t/ds/max7219_21_eng_tds.pdf?mime=application%2Fpdf&src-supplier=Distrelec; ComponentLink2Description: https://www.distrelec.biz/Web/Downloads/_t/ds/max7219_21_eng_tds.pdf?mime=application%2Fpdf&src-supplier=Distrelec
DS1 DS2 = 7SEGMENT-3DIG-CC: ComponentLink1Description: Ozdisan Link; ComponentLink1URL: https://ozdisan.com/tft-lcd-ve-led-ekranlar/led-ekran-modulleri/karakter-ve-numerik-led-displayler/E1-3056-CUR-1-CT/387322

## Sheet USB2UART.SchDoc
size A4; SheetNumber: 3; SheetTotal: 4
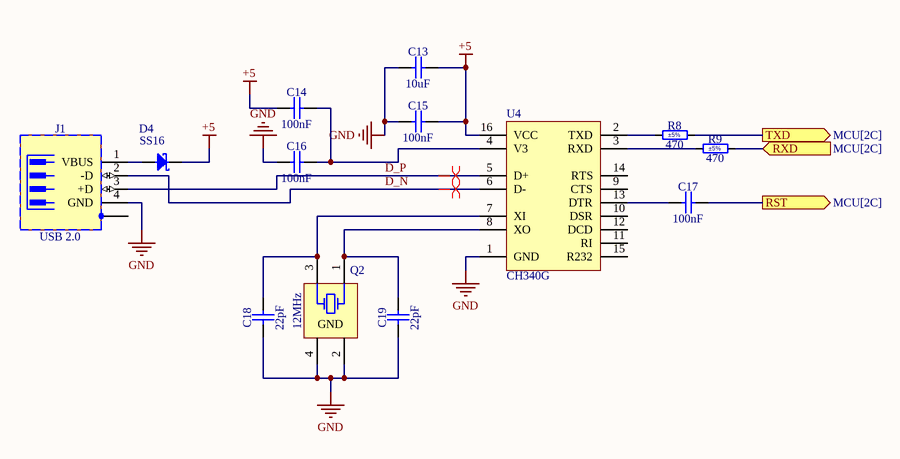
[diagram p2: USB2UART.SchDoc]

### Parts
(Parts that share a designator on the sheet are numbered #1, #2 ... from top to bottom, then left to right.)
C13  10uF  [CAPC2012X135N]
C14  100nF  [CAPC2012X135N]
C15#2  100nF  [CAPC2012X135N]
C16#2  100nF  [CAPC2012X135N]
C17#2  100nF  [CAPC2012X135N]
C18#2  22pF  [CAPC2012X88N]
C19#2  22pF  [CAPC2012X88N]
D4  SS16  [DIOM5127X229N]
J1  USB 2.0  [ASSMANN_A-USBSB]
Q2  12MHz  [XTAL_EPSON_TSX-3225]
R8  470  Tolerance: ±5%  [RESC2012X60N]
R9  470  Tolerance: ±5%  [RESC2012X60N]
U4  CH340G  [SOIC-16]

### Ports
RST (out, see MCU[2C]), RXD (in, see MCU[2C]), TXD (out, see MCU[2C])

### Nets
+5: C13.2 C14.1 C15#2.2 D4.1(C) U4.16(VCC)
GND: C13.1 C15#2.1 C16#2.1 C18#2.1 C19#2.1 J1.4(GND) Q2.2(GND) Q2.4(GND) U4.1(GND)
D_N: J1.2(-D) U4.6(D-)
D_P: J1.3(+D) U4.5(D+)
NetC14_2: C14.2 C16#2.2 U4.4(V3)
NetC17#2_1: C17#2.1 U4.13(DTR)
NetC17#2_2: C17#2.2 ; port RST
NetC18#2_2: C18#2.2 Q2.3(X) U4.7(XI)
NetC19#2_2: C19#2.2 Q2.1(X) U4.8(XO)
NetD4_2: D4.2(A) J1.1(VBUS)
NetR8_1: R8.1 U4.2(TXD)
NetR8_2: R8.2 ; port TXD
NetR9_1: R9.1 U4.3(RXD)
NetR9_2: R9.2 ; port RXD

Not connected (* = marked no-connect by the designer): J1 5(SHIELD); U4 9(CTS) 10(DSR) 11(RI) 12(DCD) 14(RTS) 15(R232)

### Layout directives
differential pair: D_N, D_P

### Library data of the parts
C13 = CC0805_10UF_10V_10%_X7R: Non-polarised capacitor; Part Description: SMD Multilayer Chip Ceramic Capacitor; Manufacturer: GENERIC; Manufacturer1 Part Number: GRM21BR71A106KE51L; Voltage: 10V; TC: X7R; Tolerance: ±10%; Part Number: CC0805_10UF_10V_10%_X7R; Component Kind: Standard; Component Type: Standard; Pin Count: 2; Value: 10uF; Status: Preferred; Manufacturer Part Number: CC0805_10UF_10V_10%_X7R; Case: 0805; Mounted: Yes; Socket: No; SMD: Yes; Sense: No; Manufacturer1 Example: MURATA; Manufacturer1 ComponentHeight: 1.35mm; HelpURL: \\cern.ch\dfs\Applications\Altium\Datasheets\CC0805_X7R_MURATA.pdf; Author: CERN DEM JLC; CreateDate: 30.04.2012; LatestRevisionDate: 30.04.2012
C14 C15#2 C16#2 C17#2 = CC0805_100NF_50V_10%_X7R: as C15#1 on sheet MCU; Part Number: CC0805_100NF_50V_10%_X7R; Component Kind: Standard; Component Type: Standard; Pin Count: 2; Value: 100nF; Status: None; Manufacturer Part Number: CC0805_100NF_50V_10%_X7R; Case: 0805; Mounted: Yes; Socket: No; SMD: Yes; Sense: No; Manufacturer1 Example: TDK; Manufacturer1 ComponentHeight: 1mm; HelpURL: \\cern.ch\dfs\Applications\Altium\Datasheets\CC0805_X7R_TDK_C.pdf; Author: CERN DEM JLC; CreateDate: 3.12.2007; LatestRevisionDate: 22.04.2015
C18#2 C19#2 = CC0805_22PF_200V_5%_C0G: Non-polarised capacitor; Part Description: SMD Multilayer Chip Ceramic Capacitor; Manufacturer: GENERIC; Manufacturer1 Part Number: C0805C220J2GAC; Voltage: 200V; TC: C0G/NP0; Tolerance: ±5%; Part Number: CC0805_22PF_200V_5%_C0G; Component Kind: Standard; Component Type: Standard; Pin Count: 2; Value: 22pF; Status: None; Manufacturer Part Number: CC0805_22PF_200V_5%_C0G; Case: 0805; Mounted: Yes; Socket: No; SMD: Yes; Sense: No; Manufacturer1 Example: KEMET; Manufacturer1 ComponentHeight: 0.88mm; HelpURL: \\cern.ch\dfs\Applications\Altium\Datasheets\CC0805_C0G_KEMET_(Commercial Grade).pdf; Author: CERN DEM MR; CreateDate: 2.06.2016; LatestRevisionDate: 2.06.2016
D4 = SS16: Schottky Diode; Part Description: Surface Mount Schottky Barrier Rectifier; Manufacturer: VISHAY GENERAL SEMICONDUCTOR; Voltage: 60V; Power: 1A; PressFit: No; Bonding: No; Part Number: SS16; Component Kind: Standard; Component Type: Standard; Device: SS16; PackageDescription: DO-214-AC/SMA Diode, Molded Body; 5.10mm L X 2.67mm W X 2.29mm H, IPC Medium Density; Manufacturer Part Number: SS16; Pin Count: 2; Case: DO-214AC; Mounted: Yes; Socket: No; SMD: Yes; Sense: No; ComponentHeight: 2.29mm; HelpURL: \\cern.ch\dfs\Applications\Altium\Datasheets\SS16.pdf; Author: CERN DEM JLC; CreateDate: 15.07.2008; LatestRevisionDate: 23.08.2010
J1 = ASSMANN_A-USBSB: 4 Pin + 1 Shield USB Receptacle; Part Description: USB 2.0 Style B Right Angle 4 Contacts Receptacle; PressFit: No; Part Number: ASSMANN_A-USBSB; Component Kind: Standard; Component Type: Standard; Pin Count: 5; Family: USB 2.0; Mounted: Yes; Socket: No; SMD: No; Sense: No; Status: None; Manufacturer: ASSMANN; Manufacturer Part Number: A-USBSB; ComponentHeight: 10.85mm; HelpURL: \\cern.ch\dfs\Applications\Altium\Datasheets\ASSMANN_A-USBSB.pdf; Author: CERN DEM JLC; CreateDate: 17.04.2018; LatestRevisionDate: 17.04.2018
Q2 = XTAL_40MHZ_EPSON_TSX-3225 40.0000MF10Z-B6: Crystal 4 pins 1=XTAL Control 2=GND3=XTAL 4=GND; Part Number: XTAL_12MHZ_EPSON_TSX-3225 12.0000MF10Z-B6; Part Description: Tolerance: ±10ppm,  Stability:±10ppm, -20°C to 75°C, 10pF, Surface Mount Quartz Crystal, TX-3225 Series; Manufacturer: EPSON; Manufacturer Part Number: TSX-3225 12.0000MF10Z-B6; PressFit: No; Bonding: No; Component Kind: Standard; Component Type: Standard; PackageDescription: Crystal, Corner Concave; 4 Pin, 2.50mm L X 3.20mm W X 0.6mm H, TSX-3225 Serie; Value: 12MHz; Pin Count: 4; Mounted: Yes; Socket: No; SMD: Yes; Sense: No; ComponentHeight: 0.6mm; HelpURL: \\cern.ch\dfs\Applications\Altium\Datasheets\XTAL_EPSON_TSX-3225.pdf; ComponentLink1URL: \\cern.ch\dfs\Applications\Altium\Datasheets\XTAL_EPSON_TSX-3225_Ordering-Informations.pdf; ComponentLink1Description: Ordering Informations; Author: CERN DEM HF; CreateDate: 24.10.2023; LatestRevisionDate: 24.10.2023
R8 R9 = R0805_470R_1%_0.125W_100PPM: Resistor - 5%; Part Number: R0805_470R_5%_0.125W_100PPM; Part Description: General Purpose Thick Film Chip Resistor; Manufacturer: GENERIC; Manufacturer1 Part Number: NRC10F4700TRF; Power: 0.125W; TC: ±100ppm/°C; PressFit: No; Component Kind: Standard; Component Type: Standard; Pin Count: 2; Value: 470; Status: Preferred; Manufacturer Part Number: R0805_470R_5%_0.125W_100PPM; Case: 0805; Mounted: Yes; Sense: No; Socket: No; SMD: Yes; Manufacturer1 Example: NIC COMPONENT; Manufacturer1 ComponentHeight: 0.6mm; HelpURL: \\cern.ch\dfs\Applications\Altium\Datasheets\R0805_NIC_NRC.pdf; Author: CERN DEM JLC; CreateDate: 3.12.2007; LatestRevisionDate: 13.03.2008
U4 = CH340G: USB to UART Converter SOP16; Manufacturer Part Number: CH340G

## Sheet Analog.SchDoc
size A4; SheetNumber: 4; SheetTotal: 4
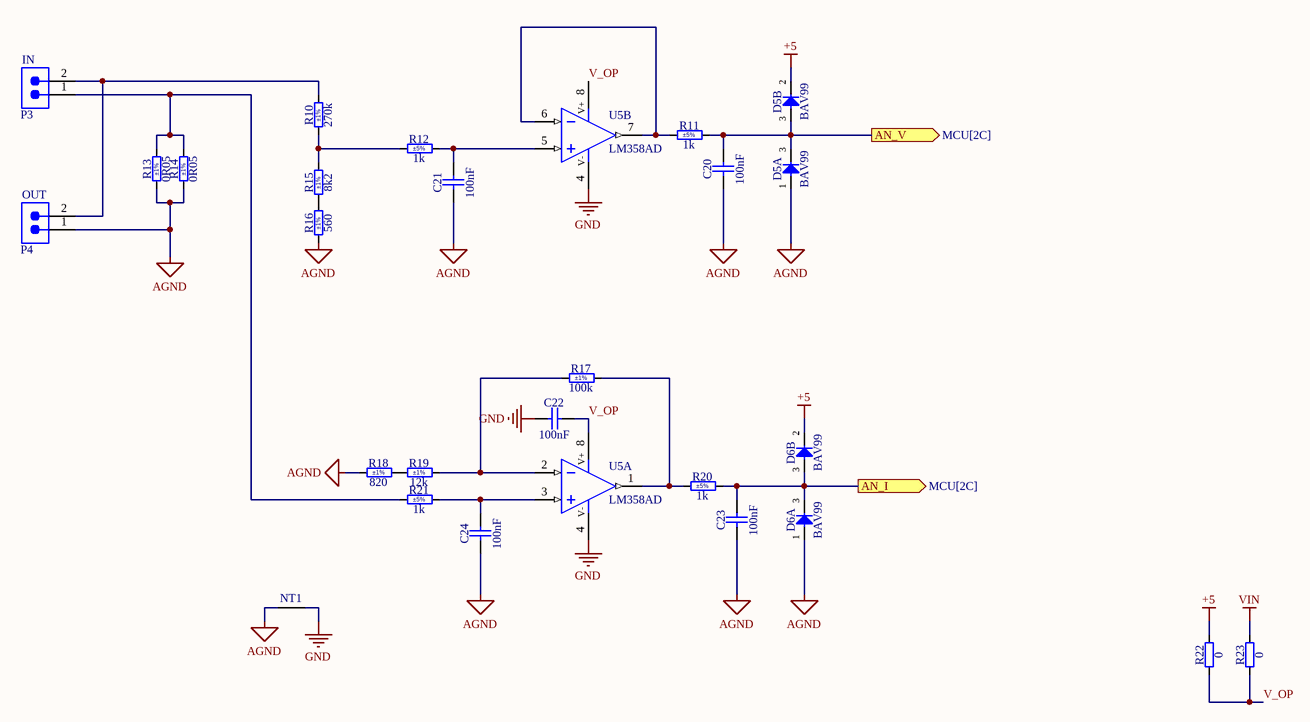
[diagram p3: Analog.SchDoc]

### Parts
(Parts that share a designator on the sheet are numbered #1, #2 ... from top to bottom, then left to right.)
C20#2  100nF  [CAPC2012X135N]
C21#2  100nF  [CAPC2012X135N]
C22#2  100nF  [CAPC2012X135N]
C23#2  100nF  [CAPC2012X135N]
C24#2  100nF  [CAPC2012X135N]
D5#2  BAV99  [SOT95P240X110-3N]  (parts A,B of 2)
D6#2  BAV99  [SOT95P240X110-3N]  (parts A,B of 2)
NT1  (no value)  [NET-TIE]  (net tie, no BOM)
P3#2  691322310002  [691322310002]  (value not drawn)
P4#2  691322310002  [691322310002]  (value not drawn)
R10  270k  Tolerance: ±1%  [RESC2012X60N]
R11  1k  Tolerance: ±5%  [RESC2012X60N]
R12  1k  Tolerance: ±5%  [RESC2012X60N]
R13#2  0R05  Tolerance: ±1%  [RESC_VISHAY_WSL2512_0R007-0R5]
R14#2  0R05  Tolerance: ±1%  [RESC_VISHAY_WSL2512_0R007-0R5]
R15#2  8k2  Tolerance: ±1%  [RESC2012X60N]
R16#2  560  Tolerance: ±1%  [RESC2012X60N]
R17#2  100k  Tolerance: ±1%  [RESC2012X60N]
R18#2  820  Tolerance: ±1%  [RESC2012X60N]
R19#2  12k  Tolerance: ±1%  [RESC2012X60N]
R20#2  1k  Tolerance: ±5%  [RESC2012X60N]
R21#2  1k  Tolerance: ±5%  [RESC2012X60N]
R22#2  0  [RESC2012X60N]
R23  0  [RESC2012X60N]
U5  LM358AD  [SOIC127P600X175-8N]  (parts A,B of 2)

### Ports
AN_I (out, see MCU[2C]), AN_V (out, see MCU[2C])

### Nets
+5: D5#2.2(C) D6#2.2(C) R22#2.2
AGND: C20#2.1 C21#2.1 C23#2.1 C24#2.1 D5#2.1(A) D6#2.1(A) NT1.1 P4#2.1 R13#2.1 R14#2.1 R16#2.1 R18#2.1
GND: C22#2.1 NT1.2 U5.4(V-)
VIN: R23.2
V_OP: C22#2.2 R22#2.1 R23.1 U5.8(V+)
NetC20#2_2: C20#2.2 D5#2.3(COMAC) R11.2 ; port AN_V
NetC21#2_2: C21#2.2 R12.2 U5.5(IN+)
NetC23#2_2: C23#2.2 D6#2.3(COMAC) R20#2.2 ; port AN_I
NetC24#2_2: C24#2.2 R21#2.2 U5.3(IN+)
NetP3#2_1: P3#2.1 R13#2.2 R14#2.2 R21#2.1
NetP3#2_2: P3#2.2 P4#2.2 R10.2
NetR10_1: R10.1 R12.1 R15#2.2
NetR11_1: R11.1 U5.6(IN-) U5.7(OUT)
NetR15#2_1: R15#2.1 R16#2.2
NetR17#2_1: R17#2.1 R19#2.2 U5.2(IN-)
NetR17#2_2: R17#2.2 R20#2.1 U5.1(OUT)
NetR18#2_2: R18#2.2 R19#2.1

### Notes on the sheet
- (near P3#2) IN
- (near P4#2) OUT

### Library data of the parts
C20#2 C21#2 C22#2 C23#2 C24#2 = CC0805_100NF_50V_10%_X7R: as C15#1 on sheet MCU; Part Number: CC0805_100NF_50V_10%_X7R; Component Kind: Standard; Component Type: Standard; Pin Count: 2; Value: 100nF; Status: None; Manufacturer Part Number: CC0805_100NF_50V_10%_X7R; Case: 0805; Mounted: Yes; Socket: No; SMD: Yes; Sense: No; Manufacturer1 Example: TDK; Manufacturer1 ComponentHeight: 1mm; HelpURL: \\cern.ch\dfs\Applications\Altium\Datasheets\CC0805_X7R_TDK_C.pdf; Author: CERN DEM JLC; CreateDate: 3.12.2007; LatestRevisionDate: 22.04.2015
D5#2 D6#2 = BAV99: Serial Diode; Part Description: Dual Series Signal Diode; Manufacturer: FAIRCHILD SEMICONDUCTOR; Voltage: 70V; Power: 350mW; PressFit: No; Bonding: No; Part Number: BAV99; Component Kind: Standard; Component Type: Standard; Device: BAV99; PackageDescription: SOT, 0.95mm Pitch; 3 Pin, 1.40mm W X 3.00mm L X 1.10mm H body, IPC Medium Density; Manufacturer Part Number: BAV99; Pin Count: 3; Case: SOT23-3; Mounted: Yes; Socket: No; SMD: Yes; Sense: No; ComponentHeight: 1.1mm; HelpURL: \\cern.ch\dfs\Applications\Altium\Datasheets\BAV99.pdf; Author: CERN DEM JLC; CreateDate: 6.05.2008; LatestRevisionDate: 27.09.2012
NT1 = Net Tie
P3#2 P4#2 = 691322310002: as P2 on sheet MCU; Manufacturer Part Number: 691322310002; Category: Terminal Blocks; Match Code: WR-TBL; ComponentLink1Description: Website Link; ComponentLink1URL: https://www.we-online.com/redexpert/article/691322310002?ad; ComponentLink2Description: Datasheet Link; ComponentLink2URL: https://www.we-online.com/redexpert/spec/691322310002?ad; Mount: Through Hole; Operating Temperature Max: 105°C; Operating Temperature Min: -40°C; Packaging: Box; Application: Pluggable; Number of Pins: 2; Number of Rows: 1; Orientation: Horizontal; Pitch: 3.81mm
R10 = R0805_270K_1%_0.125W_100PPM: Resistor - 1%; Part Description: General Purpose Thick Film Chip Resistor; Manufacturer: GENERIC; Manufacturer1 Part Number: NRC10F2703TRF; Power: 0.125W; TC: ±100ppm/°C; PressFit: No; Part Number: R0805_270K_1%_0.125W_100PPM; Component Kind: Standard; Component Type: Standard; Pin Count: 2; Value: 270k; Status: Preferred; Manufacturer Part Number: R0805_270K_1%_0.125W_100PPM; Case: 0805; Mounted: Yes; Sense: No; Socket: No; SMD: Yes; Manufacturer1 Example: NIC COMPONENT; Manufacturer1 ComponentHeight: 0.6mm; HelpURL: \\cern.ch\dfs\Applications\Altium\Datasheets\R0805_NIC_NRC.pdf; Author: CERN DEM JLC; CreateDate: 3.12.2007; LatestRevisionDate: 13.03.2008
R11 R12 R20#2 R21#2 = R0805_1K_1%_0.125W_100PPM: Resistor - 5%; Part Number: R0805_1K_5%_0.125W_100PPM; Part Description: General Purpose Thick Film Chip Resistor; Manufacturer: GENERIC; Manufacturer1 Part Number: NRC10F1001TRF; Power: 0.125W; TC: ±100ppm/°C; PressFit: No; Component Kind: Standard; Component Type: Standard; Pin Count: 2; Value: 1k; Status: Preferred; Manufacturer Part Number: R0805_1K_5%_0.125W_100PPM; Case: 0805; Mounted: Yes; Sense: No; Socket: No; SMD: Yes; Manufacturer1 Example: NIC COMPONENT; Manufacturer1 ComponentHeight: 0.6mm; HelpURL: \\cern.ch\dfs\Applications\Altium\Datasheets\R0805_NIC_NRC.pdf; Author: CERN DEM JLC; CreateDate: 3.12.2007; LatestRevisionDate: 13.03.2008
R13#2 R14#2 = R2512_0R05_1%_1W_75PPM_VISHAY_WSL: Resistor - 1%; Part Description: Power Metal Strip® Resistor; Manufacturer: VISHAY DALE; Manufacturer Part Number: WSL2512R0500FEA; Power: 1W; TC: ±75ppm/°C; PressFit: No; Part Number: R2512_0R05_1%_1W_75PPM_VISHAY_WSL; Component Kind: Standard; Component Type: Standard; Pin Count: 2; Value: 0R05; Status: None; Case: 2512; Mounted: Yes; Sense: No; Socket: No; SMD: Yes; ComponentHeight: 0.89mm; HelpURL: \\cern.ch\dfs\Applications\Altium\Datasheets\R2512_VISHAY_WSL.pdf; Author: CERN DEM BC; CreateDate: 11.11.2020; LatestRevisionDate: 11.11.2020
R15#2 = R0805_8K2_1%_0.125W_100PPM: Resistor - 1%; Part Description: General Purpose Thick Film Chip Resistor; Manufacturer: GENERIC; Manufacturer1 Part Number: NRC10F8201TRF; Power: 0.125W; TC: ±100ppm/°C; PressFit: No; Part Number: R0805_8K2_1%_0.125W_100PPM; Component Kind: Standard; Component Type: Standard; Pin Count: 2; Value: 8k2; Status: Preferred; Manufacturer Part Number: R0805_8K2_1%_0.125W_100PPM; Case: 0805; Mounted: Yes; Sense: No; Socket: No; SMD: Yes; Manufacturer1 Example: NIC COMPONENT; Manufacturer1 ComponentHeight: 0.6mm; HelpURL: \\cern.ch\dfs\Applications\Altium\Datasheets\R0805_NIC_NRC.pdf; Author: CERN DEM JLC; CreateDate: 3.12.2007; LatestRevisionDate: 13.03.2008
R16#2 = R0805_560R_1%_0.125W_100PPM: Resistor - 1%; Part Description: General Purpose Thick Film Chip Resistor; Manufacturer: GENERIC; Manufacturer1 Part Number: NRC10F5600TRF; Power: 0.125W; TC: ±100ppm/°C; PressFit: No; Part Number: R0805_560R_1%_0.125W_100PPM; Component Kind: Standard; Component Type: Standard; Pin Count: 2; Value: 560; Status: Preferred; Manufacturer Part Number: R0805_560R_1%_0.125W_100PPM; Case: 0805; Mounted: Yes; Sense: No; Socket: No; SMD: Yes; Manufacturer1 Example: NIC COMPONENT; Manufacturer1 ComponentHeight: 0.6mm; HelpURL: \\cern.ch\dfs\Applications\Altium\Datasheets\R0805_NIC_NRC.pdf; Author: CERN DEM JLC; CreateDate: 3.12.2007; LatestRevisionDate: 13.03.2008
R17#2 = R0805_100K_1%_0.125W_100PPM: Resistor - 1%; Part Description: General Purpose Thick Film Chip Resistor; Manufacturer: GENERIC; Manufacturer1 Part Number: NRC10F1003TRF; Power: 0.125W; TC: ±100ppm/°C; PressFit: No; Part Number: R0805_100K_1%_0.125W_100PPM; Component Kind: Standard; Component Type: Standard; Pin Count: 2; Value: 100k; Status: Preferred; Manufacturer Part Number: R0805_100K_1%_0.125W_100PPM; Case: 0805; Mounted: Yes; Sense: No; Socket: No; SMD: Yes; Manufacturer1 Example: NIC COMPONENT; Manufacturer1 ComponentHeight: 0.6mm; HelpURL: \\cern.ch\dfs\Applications\Altium\Datasheets\R0805_NIC_NRC.pdf; Author: CERN DEM JLC; CreateDate: 3.12.2007; LatestRevisionDate: 13.03.2008
R18#2 = R0805_820R_1%_0.125W_100PPM: Resistor - 1%; Part Description: General Purpose Thick Film Chip Resistor; Manufacturer: GENERIC; Manufacturer1 Part Number: NRC10F8200TRF; Power: 0.125W; TC: ±100ppm/°C; PressFit: No; Part Number: R0805_820R_1%_0.125W_100PPM; Component Kind: Standard; Component Type: Standard; Pin Count: 2; Value: 820; Status: Preferred; Manufacturer Part Number: R0805_820R_1%_0.125W_100PPM; Case: 0805; Mounted: Yes; Sense: No; Socket: No; SMD: Yes; Manufacturer1 Example: NIC COMPONENT; Manufacturer1 ComponentHeight: 0.6mm; HelpURL: \\cern.ch\dfs\Applications\Altium\Datasheets\R0805_NIC_NRC.pdf; Author: CERN DEM JLC; CreateDate: 3.12.2007; LatestRevisionDate: 13.03.2008
R19#2 = R0805_12K_1%_0.125W_100PPM: Resistor - 1%; Part Description: General Purpose Thick Film Chip Resistor; Manufacturer: GENERIC; Manufacturer1 Part Number: NRC10F1202TRF; Power: 0.125W; TC: ±100ppm/°C; PressFit: No; Part Number: R0805_12K_1%_0.125W_100PPM; Component Kind: Standard; Component Type: Standard; Pin Count: 2; Value: 12k; Status: Preferred; Manufacturer Part Number: R0805_12K_1%_0.125W_100PPM; Case: 0805; Mounted: Yes; Sense: No; Socket: No; SMD: Yes; Manufacturer1 Example: NIC COMPONENT; Manufacturer1 ComponentHeight: 0.6mm; HelpURL: \\cern.ch\dfs\Applications\Altium\Datasheets\R0805_NIC_NRC.pdf; Author: CERN DEM JLC; CreateDate: 3.12.2007; LatestRevisionDate: 13.03.2008
R22#2 R23 = R0805_0R_JUMPER: Resistor; Part Description: 2A (0.05R Max DC Resistance) Zero Ohm Jumper; Manufacturer: GENERIC; Manufacturer1 Part Number: NRC10Z0; PressFit: No; Part Number: R0805_0R_JUMPER; Component Kind: Standard; Component Type: Standard; Pin Count: 2; Value: 0; Status: Preferred; Manufacturer Part Number: R0805_0R_JUMPER; Case: 0805; Mounted: Yes; Sense: No; Socket: No; SMD: Yes; Manufacturer1 Example: NIC COMPONENT; Manufacturer1 ComponentHeight: 0.6mm; HelpURL: \\cern.ch\dfs\Applications\Altium\Datasheets\R0805_NIC_NRC.pdf; Author: CERN DEM JLC; CreateDate: 3.12.2007; LatestRevisionDate: 13.03.2008
U5 = LM358AD: Dual Operational Amplifier; Part Description: Dual Operational Amplifier, Vos=3mV, Iq/CH=350uA, 0°C to 70°C; Manufacturer: TEXAS INSTRUMENTS; PressFit: No; Bonding: No; Part Number: LM358AD; Component Kind: Standard; Component Type: Standard; Device: LM358AD; PackageDescription: SOIC 8, Pitch 1.27mm - Body 4x5mm, IPC Medium Density; Manufacturer Part Number: LM358AD; Pin Count: 8; Case: SOIC8; Mounted: Yes; Socket: No; SMD: Yes; Sense: No; ComponentHeight: 1.75mm; Author: CERN DEM JLC; HelpURL: \\cern.ch\dfs\Applications\Altium\Datasheets\LM358A.pdf; CreateDate: 2.12.2008; LatestRevisionDate: 6.09.2021

## Nets that join several sheets
+5: Display (C12.2 R7.2 U3.19), USB2UART (5 pins), Analog (D5#2.2 D6#2.2 R22#2.2)
GND: MCU (36 pins), Display (C12.1 U3.4 U3.9), USB2UART (9 pins), Analog (C22#2.1 NT1.2 U5.4)

## Assembly variants
Not Fit: not fitted C? R23